# Altium project DB-X01.PrjPcb (part 2 of 5)
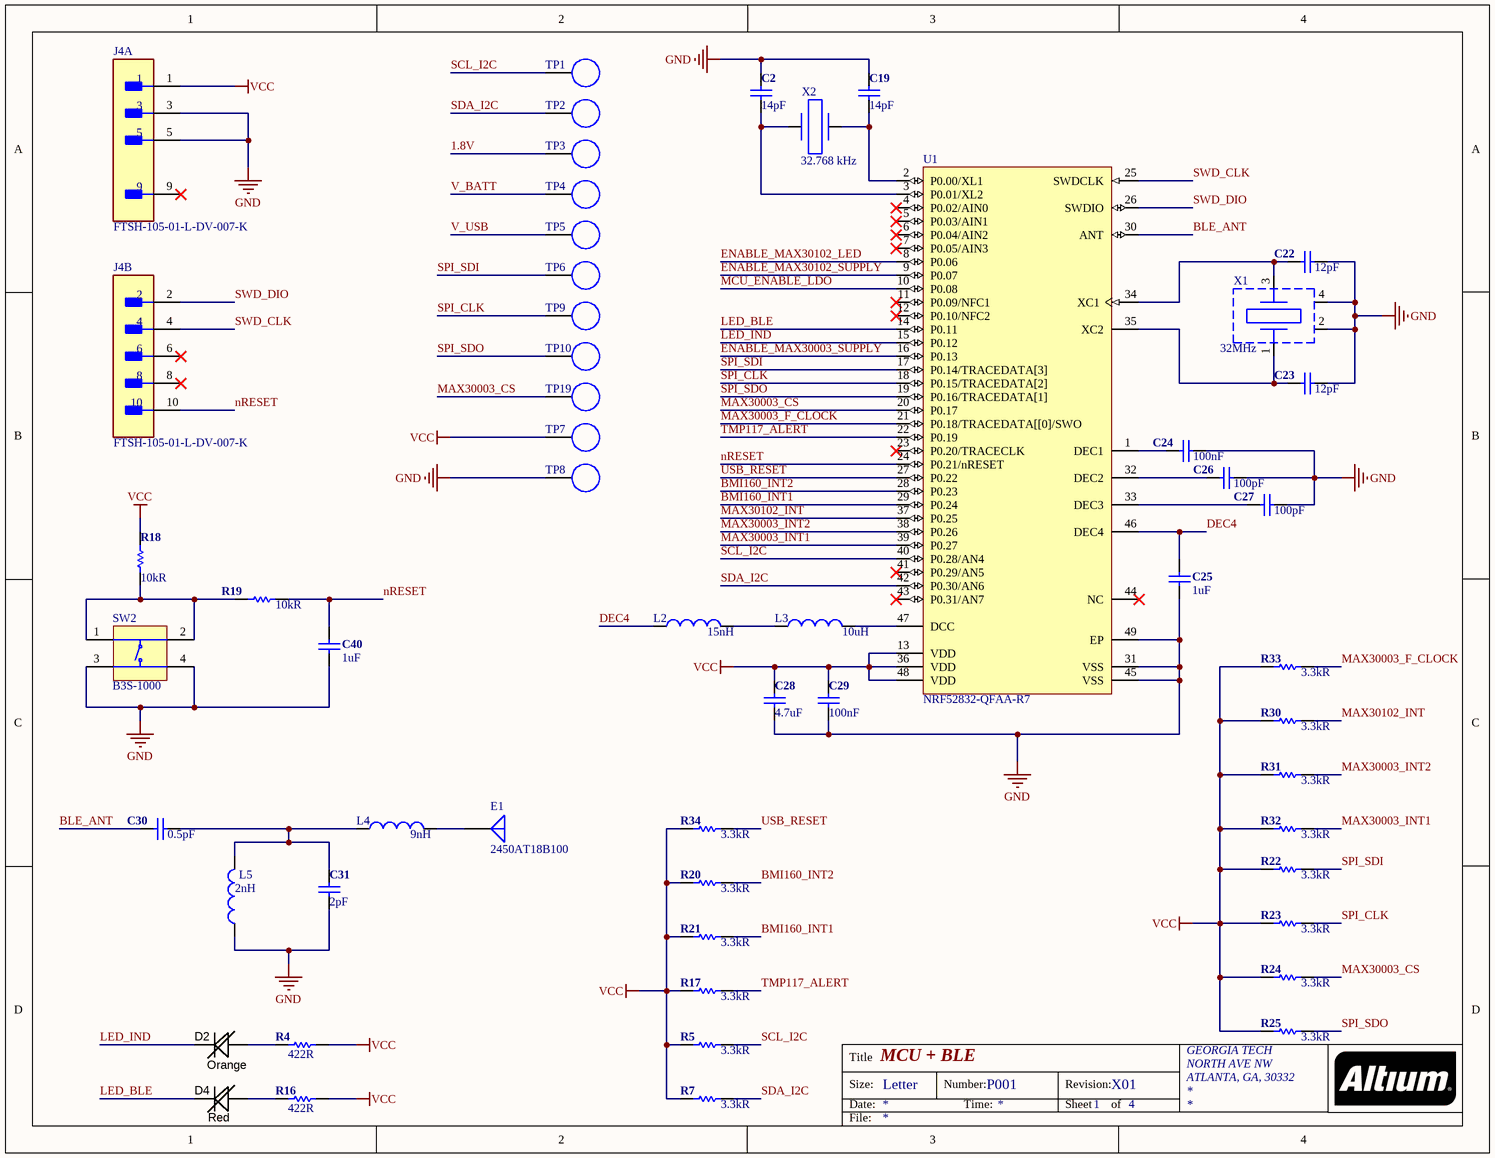
[diagram p2: DB_Main-X01.SchDoc]

## Sheet DB_Main-X01.SchDoc: MCU + BLE (continued)

### Library data of the parts
C2 C19 = C-0402(1005): Ceramic Capacitor, Multilayer, Ceramic, 50V, 1% +Tol, 1% -Tol, C0G, 30ppm/Cel TC, 0.000014uF, Surface Mount, 0402; Manufacturer: Kyocera AVX; Manufacturer Part Number: 04025U140FAT2A; ComponentLink1URL: https://datasheet.ciiva.com/169/product-169683.pdf; ComponentLink1Description: https://datasheet.ciiva.com/169/product-169683.pdf; Supplier 1: Digi-Key; Supplier Part Number 1: 478-10139-1-ND; RoHS: Yes; Category: Ceramic Capacitors; Stock 1: 25036; Pricing 1: 1=0.35000, 10=0.24100, 100=0.14460, 500=0.10846, 1000=0.09158, 2500=0.08676, 5000=0.08194 (USD); Mount: Surface Mount; Case/Package: 0402; Case Code (Imperial): 0402; Case Code (Metric): 1005; Min Operating Temperature: -55°C; Max Operating Temperature: 125°C; Dielectric: C0G; Capacitance: 14pF; Package Quantity: 10000; Voltage Rating: 50V; Voltage Rating (DC): 50V; Tolerance: 1%; Packaging: Tape and Reel; Termination: SMD/SMT; Composition: Ceramic; Length: 1mm; Width: 0.5mm; Thickness: 0.022inch; Depth: 0.5mm; Radiation Hardening: No; ComponentLink2URL: https://datasheet.ciiva.com:443/pdfs/VipMasterIC/IC/AVXC/AVXC-S-A0001948465/AVXC-S-A0001948465-1.pdf?src-supplier=IHS+Markit; ComponentLink2Description: https://datasheet.ciiva.com:443/pdfs/VipMasterIC/IC/AVXC/AVXC-S-A0001948465/AVXC-S-A0001948465-1.pdf?src-supplier=IHS+Markit; ComponentLink3URL: https://datasheet.ciiva.com/6269/useries-6269558.pdf?src-supplier=Digi-Key; ComponentLink3Description: https://datasheet.ciiva.com/6269/useries-6269558.pdf?src-supplier=Digi-Key; ComponentLink4URL: https://datasheet.ciiva.com/11568/useries-11568551.pdf?src-supplier=Avnet; ComponentLink4Description: https://datasheet.ciiva.com/11568/useries-11568551.pdf?src-supplier=Avnet
C22 C23 = C-0402(1005): Ceramic Capacitor, Multilayer, Ceramic, 50V, 1% +Tol, 1% -Tol, C0G, 30ppm/Cel TC, 0.000012uF, Surface Mount, 0402; Manufacturer: Kyocera AVX; Manufacturer Part Number: 04025U120FAT2A; ComponentLink1URL: https://datasheet.ciiva.com/169/product-169683.pdf; ComponentLink1Description: https://datasheet.ciiva.com/169/product-169683.pdf; Supplier 1: Digi-Key; Supplier Part Number 1: 478-10136-1-ND; RoHS: Yes; Category: Ceramic Capacitors; Stock 1: 30880; Pricing 1: 1=0.33000, 10=0.22700, 100=0.13630, 500=0.10220, 1000=0.08630, 2500=0.08176, 5000=0.07721 (USD); Mount: Surface Mount; Case/Package: 0402; Weight: 2.3E-05oz; Case Code (Metric): 1005; Case Code (Imperial): 0402; Min Operating Temperature: -55°C; Max Operating Temperature: 125°C; Termination: SMD/SMT; Composition: Ceramic; Tolerance: 1%; Packaging: Tape and Reel; Package Quantity: 10000; Capacitance: 12pF; Voltage Rating: 50V; Voltage Rating (DC): 50V; Dielectric: C0G; Length: 1mm; Height: 0.02mm; Thickness: 0.022inch; Depth: 0.5mm; Width: 0.02inch; Radiation Hardening: No; Lead Free: Lead Free; ComponentLink2URL: https://datasheet.ciiva.com:443/pdfs/VipMasterIC/IC/AVXC/AVXC-S-A0008668660/AVXC-S-A0008668660-1.pdf?src-supplier=IHS+Markit; ComponentLink2Description: https://datasheet.ciiva.com:443/pdfs/VipMasterIC/IC/AVXC/AVXC-S-A0008668660/AVXC-S-A0008668660-1.pdf?src-supplier=IHS+Markit; ComponentLink3URL: https://datasheet.ciiva.com/16327/useries-16327642.pdf?src-supplier=Future+Electronics; ComponentLink3Description: https://datasheet.ciiva.com/16327/useries-16327642.pdf?src-supplier=Future+Electronics; ComponentLink4URL: https://datasheet.ciiva.com/11568/useries-11568940.pdf?src-supplier=Avnet; ComponentLink4Description: https://datasheet.ciiva.com/11568/useries-11568940.pdf?src-supplier=Avnet
C24 = C-0402(1005): Ceramic Capacitor, Multilayer, Ceramic, 25V, 10% +Tol, 10% -Tol, X5R, 15% TC, 0.1uF, Surface Mount, 0402; Manufacturer: Taiyo Yuden; Manufacturer Part Number: TMK105BJ104KV-F; ComponentLink1URL: https://datasheet.ciiva.com/169/product-169683.pdf; ComponentLink1Description: https://datasheet.ciiva.com/169/product-169683.pdf; Supplier 1: Digi-Key; Supplier Part Number 1: 587-1456-1-ND; RoHS: Yes; Category: Ceramic Capacitors; Stock 1: 27456801; Pricing 1: 1=0.10000, 10=0.04600, 100=0.02050, 500=0.01464, 1000=0.01150, 2500=0.01045, 5000=0.00961 (USD); Mount: Surface Mount; Case/Package: 0402; Number of Pins: 2; Weight: 2.3E-05oz; Case Code (Imperial): 0402; Case Code (Metric): 1005; Min Operating Temperature: -55°C; Max Operating Temperature: 85°C; Capacitance: 100nF; Tolerance: 10%; Packaging: Tape and Reel; Dielectric: X5R; Voltage Rating (DC): 25V; Voltage Rating: 25V; Package Quantity: 1; Termination: SMD/SMT; Composition: Ceramic; Voltage: 25V; Length: 1mm; Height: 0.5mm; Width: 0.5mm; Depth: 0.5mm; Thickness: 0.022inch; REACH SVHC: No SVHC; Lead Free: Lead Free; Halogen Free: Halogen Free; ComponentLink2URL: https://datasheet.ciiva.com:443/pdfs/VipMasterIC/IC/TAIY/TAIY-S-A0009103435/TAIY-S-A0009103038-1.pdf?src-supplier=IHS+Markit; ComponentLink2Description: https://datasheet.ciiva.com:443/pdfs/VipMasterIC/IC/TAIY/TAIY-S-A0009103435/TAIY-S-A0009103038-1.pdf?src-supplier=IHS+Markit; ComponentLink3URL: https://datasheet.ciiva.com/30051/25tmk105bj104kv-f-30051094.pdf?src-supplier=Onlinecomponents.com; ComponentLink3Description: https://datasheet.ciiva.com/30051/25tmk105bj104kv-f-30051094.pdf?src-supplier=Onlinecomponents.com; ComponentLink4URL: https://datasheet.ciiva.com/15922/28tmk105bj104kv-f-15922315.pdf?src-supplier=Onlinecomponents.com; ComponentLink4Description: https://datasheet.ciiva.com/15922/28tmk105bj104kv-f-15922315.pdf?src-supplier=Onlinecomponents.com; ComponentLink5URL: https://datasheet.ciiva.com/131/tmk105bj104kv-f-ss-131420.pdf?src-supplier=Digi-Key; ComponentLink5Description: https://datasheet.ciiva.com/131/tmk105bj104kv-f-ss-131420.pdf?src-supplier=Digi-Key; ComponentLink6URL: https://datasheet.ciiva.com/22768/1693457-22768649.pdf?src-supplier=Farnell; ComponentLink6Description: https://datasheet.ciiva.com/22768/1693457-22768649.pdf?src-supplier=Farnell
C25 C40 = C-0402(1005): Ceramic Capacitor, Multilayer, Ceramic, 6.3V, 20% +Tol, 20% -Tol, X5R, 15% TC, 1uF, Surface Mount, 0402; Manufacturer: Yageo; Manufacturer Part Number: CC0402MRX5R5BB105; Dissipation Factor: 10%; ComponentLink1URL: https://datasheet.ciiva.com/169/product-169683.pdf; ComponentLink1Description: https://datasheet.ciiva.com/169/product-169683.pdf; Supplier 1: Digi-Key; Supplier Part Number 1: 311-1441-1-ND; RoHS: Yes; Category: Ceramic Capacitors; Stock 1: 16697; Pricing 1: 1=0.13000, 10=0.08900, 100=0.04200, 500=0.02946, 1000=0.02439, 2500=0.02270, 5000=0.02076 (USD); Mount: Surface Mount; Case/Package: 0402; Number of Pins: 2; Case Code (Imperial): 0402; Case Code (Metric): 1005; Min Operating Temperature: -55°C; Max Operating Temperature: 85°C; Capacitance: 1uF; Tolerance: 20%; Voltage Rating: 6.3V; Voltage Rating (DC): 6.3V; Packaging: Tape and Reel; Package Quantity: 1; Dielectric: X5R; Termination: SMD/SMT; Composition: Ceramic; Length: 1mm; Height: 0.5mm; Width: 0.5mm; Thickness: 0.022inch; Depth: 0.5mm; Lead Free: Lead Free; Halogen Free: Halogen Free; ComponentLink2URL: https://datasheet.ciiva.com:443/pdfs/VipMasterIC/IC/YAGO/YAGO-S-A0006851646/YAGO-S-A0006851646-1.pdf?src-supplier=IHS+Markit; ComponentLink2Description: https://datasheet.ciiva.com:443/pdfs/VipMasterIC/IC/YAGO/YAGO-S-A0006851646/YAGO-S-A0006851646-1.pdf?src-supplier=IHS+Markit; ComponentLink3URL: https://datasheet.ciiva.com/176/mlccorderingcode-176806.pdf?src-supplier=Digi-Key; ComponentLink3Description: https://datasheet.ciiva.com/176/mlccorderingcode-176806.pdf?src-supplier=Digi-Key; ComponentLink4URL: https://datasheet.ciiva.com/176/mlccorderingcode-176807.pdf?src-supplier=Digi-Key; ComponentLink4Description: https://datasheet.ciiva.com/176/mlccorderingcode-176807.pdf?src-supplier=Digi-Key; ComponentLink5URL: https://datasheet.ciiva.com/176/mlccorderingcode-176808.pdf?src-supplier=Digi-Key; ComponentLink5Description: https://datasheet.ciiva.com/176/mlccorderingcode-176808.pdf?src-supplier=Digi-Key
C26 C27 = C-0402(1005): Ceramic Capacitor, Multilayer, Ceramic, 50V, 1% +Tol, 1% -Tol, C0G, 30ppm/Cel TC, 0.0001uF, Surface Mount, 0402; Manufacturer: Yageo; Manufacturer Part Number: CC0402FRNPO9BN101; ComponentLink1URL: https://datasheet.ciiva.com/169/product-169683.pdf; ComponentLink1Description: https://datasheet.ciiva.com/169/product-169683.pdf; Supplier 1: Digi-Key; Supplier Part Number 1: 311-3329-1-ND; RoHS: Yes; Category: Ceramic Capacitors; Stock 1: 22812; Pricing 1: 1=0.11000, 10=0.08200, 100=0.03840, 500=0.02690, 1000=0.02228, 2500=0.02073, 5000=0.01897 (USD); Mount: Surface Mount; Case/Package: 0402; Case Code (Imperial): 0402; Case Code (Metric): 1005; Min Operating Temperature: -55°C; Max Operating Temperature: 125°C; Package Quantity: 10000; Voltage Rating (DC): 50V; Dielectric: C0G; Termination: SMD/SMT; Composition: Ceramic; Packaging: Tape and Reel; Capacitance: 100pF; Tolerance: 1%; Voltage Rating: 50V; Length: 1mm; Width: 0.02inch; Thickness: 0.022inch; Depth: 0.5mm; Lead Free: Lead Free; ComponentLink2URL: https://datasheet.ciiva.com:443/pdfs/VipMasterIC/IC/YAGO/YAGO-S-A0009251638/YAGO-S-A0009251638-1.pdf?src-supplier=IHS+Markit; ComponentLink2Description: https://datasheet.ciiva.com:443/pdfs/VipMasterIC/IC/YAGO/YAGO-S-A0009251638/YAGO-S-A0009251638-1.pdf?src-supplier=IHS+Markit; ComponentLink3URL: http://www.mouser.com/ds/2/447/Yageo_UPY-GP_NP0_16V-to-50V_9-358835.pdf?src-supplier=Mouser; ComponentLink3Description: http://www.mouser.com/ds/2/447/Yageo_UPY-GP_NP0_16V-to-50V_9-358835.pdf?src-supplier=Mouser; ComponentLink4URL: http://components.arrow.com/part/dataview/0323_00775990?src-supplier=Arrow+Europe; ComponentLink4Description: http://components.arrow.com/part/dataview/0323_00775990?src-supplier=Arrow+Europe; ComponentLink5URL: http://www.yageo.com/NewPortal/yageodocoutput?fileName=/pdf/MLCC/UPY-GP_NP0_16V-to-50V_14.pdf&src-supplier=Digi-Key; ComponentLink5Description: http://www.yageo.com/NewPortal/yageodocoutput?fileName=/pdf/MLCC/UPY-GP_NP0_16V-to-50V_14.pdf&src-supplier=Digi-Key; ComponentLink6URL: http://www.yageo.com/documents/recent/UPY-GP_NP0_16V-to-50V_16.pdf?src-supplier=Digi-Key; ComponentLink6Description: http://www.yageo.com/documents/recent/UPY-GP_NP0_16V-to-50V_16.pdf?src-supplier=Digi-Key; ComponentLink7URL: http://www.yageo.com/documents/recent/UPY-GP_NP0_16V-to-50V_9.pdf?src-supplier=Future+Electronics; ComponentLink7Description: http://www.yageo.com/documents/recent/UPY-GP_NP0_16V-to-50V_9.pdf?src-supplier=Future+Electronics
C28 = C-0402(1005): 0402 10 V 4.7 uF ±20% Tolerance X5R Multilayer Ceramic Chip Capacitor; Manufacturer: Murata; Manufacturer Part Number: GRM155R61A475MEAAD; Voltage Rating: 10V; ComponentLink1URL: https://datasheet.ciiva.com/169/product-169683.pdf; ComponentLink1Description: https://datasheet.ciiva.com/169/product-169683.pdf; Supplier 1: Digi-Key; Supplier Part Number 1: 490-14306-1-ND; Category: Ceramic Capacitors; Stock 1: 420733; Pricing 1: 1=0.25000, 10=0.16900, 100=0.08560, 500=0.05854, 1000=0.05179, 2500=0.04954, 5000=0.04503 (USD); Mount: Surface Mount; Case/Package: 0402; Case Code (Imperial): 0402; Case Code (Metric): 1005; Min Operating Temperature: -55°C; Max Operating Temperature: 85°C; Packaging: Tape and Reel; Capacitance: 4.7uF; Tolerance: 20%; ComponentLink2URL: https://psearch.en.murata.com:443/capacitor/product/GRM155R61A475MEAA%23.pdf?src-supplier=IHS+Markit; ComponentLink2Description: https://psearch.en.murata.com:443/capacitor/product/GRM155R61A475MEAA%23.pdf?src-supplier=IHS+Markit; ComponentLink3URL: http://www.farnell.com/datasheets/2189109.pdf?src-supplier=Farnell; ComponentLink3Description: http://www.farnell.com/datasheets/2189109.pdf?src-supplier=Farnell; ComponentLink4URL: https://search.murata.co.jp/Ceramy/image/img/A01X/G101/ENG/GRM155R61A475MEAA-01.pdf?src-supplier=Digi-Key; ComponentLink4Description: https://search.murata.co.jp/Ceramy/image/img/A01X/G101/ENG/GRM155R61A475MEAA-01.pdf?src-supplier=Digi-Key; ComponentLink5URL: http://www.farnell.com/datasheets/2189109.pdf?src-supplier=Element14; ComponentLink5Description: http://www.farnell.com/datasheets/2189109.pdf?src-supplier=Element14; ComponentLink6URL: http://www.farnell.com/datasheets/2189109.pdf?src-supplier=Newark; ComponentLink6Description: http://www.farnell.com/datasheets/2189109.pdf?src-supplier=Newark; ComponentLink7URL: http://datasheet.octopart.com/GRM155R61A475MEAAD-Murata-datasheet-138740730.pdf?src-supplier=Ciiva+Crawler; ComponentLink7Description: http://datasheet.octopart.com/GRM155R61A475MEAAD-Murata-datasheet-138740730.pdf?src-supplier=Ciiva+Crawler; ComponentLink8URL: http://datasheet.octopart.com/GRM155R61A475MEAAD-Murata-datasheet-140690084.pdf?src-supplier=Ciiva+Crawler; ComponentLink8Description: http://datasheet.octopart.com/GRM155R61A475MEAAD-Murata-datasheet-140690084.pdf?src-supplier=Ciiva+Crawler; ComponentLink9URL: http://datasheet.octopart.com/GRM155R61A475MEAAD-Murata-datasheet-68589269.pdf?src-supplier=Newark; ComponentLink9Description: http://datasheet.octopart.com/GRM155R61A475MEAAD-Murata-datasheet-68589269.pdf?src-supplier=Newark; ComponentLink10URL: http://datasheet.octopart.com/GRM155R61A475MEAAD-Murata-datasheet-8819587.pdf; ComponentLink10Description: http://datasheet.octopart.com/GRM155R61A475MEAAD-Murata-datasheet-8819587.pdf; ComponentLink11URL: http://datasheet.octopart.com/GRM155R61A475MEAAD-Murata-datasheet-10025737.pdf; ComponentLink11Description: http://datasheet.octopart.com/GRM155R61A475MEAAD-Murata-datasheet-10025737.pdf; ComponentLink12URL: http://datasheet.octopart.com/GRM155R61A475MEAAD-Murata-datasheet-11978611.pdf; ComponentLink12Description: http://datasheet.octopart.com/GRM155R61A475MEAAD-Murata-datasheet-11978611.pdf; ComponentLink13URL: http://datasheet.octopart.com/GRM155R61A475MEAAD-Murata-datasheet-12510076.pdf; ComponentLink13Description: http://datasheet.octopart.com/GRM155R61A475MEAAD-Murata-datasheet-12510076.pdf; ComponentLink14URL: http://datasheet.octopart.com/GRM155R61A475MEAAD-Murata-datasheet-12515295.pdf; ComponentLink14Description: http://datasheet.octopart.com/GRM155R61A475MEAAD-Murata-datasheet-12515295.pdf
C29 = C-0603(1608): Ceramic Capacitor, Multilayer, Ceramic, 25V, 80% +Tol, 20% -Tol, Y5V, -82/+22% TC, 0.1uF, Surface Mount, 0402; Manufacturer: Yageo; Manufacturer Part Number: CC0402ZRY5V8BB104; Dissipation Factor: 12.5%; Insulation Resistance: 10GR; ComponentLink1URL: https://datasheet.ciiva.com/169/product-169683.pdf; ComponentLink1Description: https://datasheet.ciiva.com/169/product-169683.pdf; Supplier 1: Digi-Key; Supplier Part Number 1: 311-1375-1-ND; RoHS: Yes; Category: Ceramic Capacitors; Stock 1: 3200380; Pricing 1: 1=0.10000, 10=0.03200, 100=0.01440, 500=0.01028, 1000=0.00808, 2500=0.00734, 5000=0.00676 (USD); Mount: Surface Mount; Case/Package: 0402; Number of Pins: 2; Weight: 2.3E-05oz; Case Code (Metric): 1005; Case Code (Imperial): 0402; Min Operating Temperature: -30°C; Max Operating Temperature: 85°C; Packaging: Tape and Reel; Capacitance: 100nF; Tolerance: 80%; Voltage Rating: 25V; Voltage Rating (DC): 25V; Package Quantity: 1; Dielectric: Y5V; Termination: SMD/SMT; Composition: Ceramic; Length: 1mm; Height: 0.5mm; Width: 0.02inch; Thickness: 0.022inch; Depth: 0.5mm; Radiation Hardening: No; REACH SVHC: Unknown; Lead Free: Lead Free; Halogen Free: Halogen Free; ComponentLink2URL: https://datasheet.ciiva.com:443/pdfs/VipMasterIC/IC/YAGO/YAGO-S-A0004841839/YAGO-S-A0004841839-1.pdf?src-supplier=IHS+Markit; ComponentLink2Description: https://datasheet.ciiva.com:443/pdfs/VipMasterIC/IC/YAGO/YAGO-S-A0004841839/YAGO-S-A0004841839-1.pdf?src-supplier=IHS+Markit; ComponentLink3URL: https://datasheet.ciiva.com/144/mlccorderingcode-144022.pdf?src-supplier=Digi-Key; ComponentLink3Description: https://datasheet.ciiva.com/144/mlccorderingcode-144022.pdf?src-supplier=Digi-Key; ComponentLink4URL: https://datasheet.ciiva.com/144/mlccorderingcode-144023.pdf?src-supplier=Digi-Key; ComponentLink4Description: https://datasheet.ciiva.com/144/mlccorderingcode-144023.pdf?src-supplier=Digi-Key; ComponentLink5URL: https://datasheet.ciiva.com/144/mlccorderingcode-144024.pdf?src-supplier=Digi-Key; ComponentLink5Description: https://datasheet.ciiva.com/144/mlccorderingcode-144024.pdf?src-supplier=Digi-Key; ComponentLink6URL: https://datasheet.ciiva.com/7978/1132289-7978124.pdf?src-supplier=Element14; ComponentLink6Description: https://datasheet.ciiva.com/7978/1132289-7978124.pdf?src-supplier=Element14; ComponentLink7URL: https://datasheet.ciiva.com/11586/upy-gphc-y5v-6-3v-to-50v-5-11586526.pdf?src-supplier=Avnet; ComponentLink7Description: https://datasheet.ciiva.com/11586/upy-gphc-y5v-6-3v-to-50v-5-11586526.pdf?src-supplier=Avnet; ComponentLink8URL: https://datasheet.ciiva.com/17437/upy-gphc-y5v-6-3v-to-50v-5-17437230.pdf?src-supplier=Avnet+Europe; ComponentLink8Description: https://datasheet.ciiva.com/17437/upy-gphc-y5v-6-3v-to-50v-5-17437230.pdf?src-supplier=Avnet+Europe
C30 = C-0402(1005): Ceramic Capacitor, Multilayer, Ceramic, 50V, 10% +Tol, 10% -Tol, C0G, 30ppm/Cel TC, 0.0000005uF, Surface Mount, 0402; Manufacturer: Murata; Manufacturer Part Number: GJM1555C1HR50WB01D; ComponentLink1URL: https://datasheet.ciiva.com/169/product-169683.pdf; ComponentLink1Description: https://datasheet.ciiva.com/169/product-169683.pdf; Supplier 1: Digi-Key; Supplier Part Number 1: 490-11250-1-ND; RoHS: Yes; Category: Ceramic Capacitors; Stock 1: 75988; Pricing 1: 1=0.30000, 10=0.20500, 100=0.11610, 500=0.08198, 1000=0.07173, 2500=0.06831, 5000=0.06319 (USD); Mount: Surface Mount; Case/Package: 0402; Case Code (Metric): 1005; Case Code (Imperial): 0402; Min Operating Temperature: -55°C; Max Operating Temperature: 125°C; Package Quantity: 10000; Capacitance: 0.5pF; Voltage Rating: 50V; Packaging: Tape and Reel; Voltage Rating (DC): 50V; Dielectric: C0G; Termination: SMD/SMT; Voltage: 50V; Length: 1mm; Height: 0.5mm; Width: 0.02inch; Thickness: 0.022inch; Depth: 0.5mm; Radiation Hardening: No; Lead Free: Lead Free; ComponentLink2URL: https://datasheet.ciiva.com:443/pdfs/VipMasterIC/IC/MURE/MURE-S-A0004378008/MURE-S-A0004383131-1.pdf?src-supplier=IHS+Markit; ComponentLink2Description: https://datasheet.ciiva.com:443/pdfs/VipMasterIC/IC/MURE/MURE-S-A0004378008/MURE-S-A0004383131-1.pdf?src-supplier=IHS+Markit; ComponentLink3URL: https://datasheet.ciiva.com/169/product-169683.pdf?src-supplier=Digi-Key; ComponentLink3Description: https://datasheet.ciiva.com/169/product-169683.pdf?src-supplier=Digi-Key
C31 = C-0402(1005): Ceramic Capacitor, Multilayer, Ceramic, 50V, 5% +Tol, 5% -Tol, C0G, 30ppm/Cel TC, 0.000002uF, Surface Mount, 0402; Manufacturer: Murata; Manufacturer Part Number: GJM1555C1H2R0BB01D; ComponentLink1URL: https://datasheet.ciiva.com/169/product-169683.pdf; ComponentLink1Description: https://datasheet.ciiva.com/169/product-169683.pdf; Supplier 1: Digi-Key; Supplier Part Number 1: 490-8091-1-ND; RoHS: Yes; Category: Ceramic Capacitors; Stock 1: 969; Pricing 1: 1=0.19000, 10=0.13000, 100=0.06590, 500=0.04508, 1000=0.03987, 2500=0.03814, 5000=0.03467 (USD); Mount: Surface Mount; Case/Package: 0402; Number of Pins: 2; Case Code (Metric): 1005; Case Code (Imperial): 0402; Min Operating Temperature: -55°C; Max Operating Temperature: 125°C; Package Quantity: 1; Packaging: Tape and Reel; Capacitance: 2pF; Voltage Rating: 50V; Voltage Rating (DC): 50V; Dielectric: C0G; Termination: SMD/SMT; Length: 1mm; Height: 0.5mm; Width: 0.5mm; Thickness: 0.022inch; Lead Pitch: 0.3mm; Depth: 0.5mm; Radiation Hardening: No; REACH SVHC: No SVHC; Lead Free: Lead Free; ComponentLink2URL: https://datasheet.ciiva.com:443/pdfs/VipMasterIC/IC/MURE/MURE-S-A0008911154/MURE-S-A0008911197-1.pdf?src-supplier=IHS+Markit; ComponentLink2Description: https://datasheet.ciiva.com:443/pdfs/VipMasterIC/IC/MURE/MURE-S-A0008911154/MURE-S-A0008911197-1.pdf?src-supplier=IHS+Markit; ComponentLink3URL: https://datasheet.ciiva.com/5694/1700193-5694978.pdf?src-supplier=Farnell; ComponentLink3Description: https://datasheet.ciiva.com/5694/1700193-5694978.pdf?src-supplier=Farnell; ComponentLink4URL: https://datasheet.ciiva.com/17453/product-17453487.pdf?src-supplier=Avnet+Europe; ComponentLink4Description: https://datasheet.ciiva.com/17453/product-17453487.pdf?src-supplier=Avnet+Europe; ComponentLink5URL: https://datasheet.ciiva.com/16440/l0005e-16440476.pdf?src-supplier=Future+Electronics; ComponentLink5Description: https://datasheet.ciiva.com/16440/l0005e-16440476.pdf?src-supplier=Future+Electronics
D2 = LED_0402(1005): Single Color LED, Super Bright Orange, Water Clear, 0.8mm; Manufacturer: Kingbright; Manufacturer Part Number: APHHS1005SECK; Number of LEDs: 1; Dominant Wavelength: 601nm; Test Current: 20mA; Viewing Angle: 120°; Lens Style: Clear,Flat; Luminous Intensity: 240mcd; Forward Voltage: 2.1V; Supplier 1: Digi-Key; Supplier Part Number 1: 754-1103-1-ND; RoHS: Yes; Category: LEDs; Stock 1: 18062; Pricing 1: 1=0.50000, 10=0.35400, 100=0.20650, 500=0.14160, 1000=0.11800 (USD); Mount: Surface Mount; Case/Package: 0402; Number of Pins: 2; Lens Color: Clear; Color: Orange; Case Code (Imperial): 0402; Case Code (Metric): 1005; Min Operating Temperature: -40°C; Max Operating Temperature: 85°C; Package Quantity: 2000; Packaging: Tape and Reel; Wavelength: 601nm; Illumination Color: Orange; Forward Current: 20mA; Length: 1mm; Height: 0.6mm; Width: 0.5mm; Lead Free: Lead Free; ComponentLink1URL: https://datasheet.ciiva.com:443/pdfs/VipMasterIC/IC/KNGB/KNGBS06640/KNGBS06640-1.pdf?src-supplier=IHS+Markit; ComponentLink1Description: https://datasheet.ciiva.com:443/pdfs/VipMasterIC/IC/KNGB/KNGBS06640/KNGBS06640-1.pdf?src-supplier=IHS+Markit; ComponentLink2URL: https://datasheet.ciiva.com/2114/aphhs1005seck-2114149.pdf?src-supplier=Digi-Key; ComponentLink2Description: https://datasheet.ciiva.com/2114/aphhs1005seck-2114149.pdf?src-supplier=Digi-Key; ComponentLink3URL: https://datasheet.ciiva.com/4688/aphhs1005seck-36485-4688716.pdf?src-supplier=Mouser; ComponentLink3Description: https://datasheet.ciiva.com/4688/aphhs1005seck-36485-4688716.pdf?src-supplier=Mouser; ComponentLink4URL: https://datasheet.ciiva.com/2114/aphhs1005seck-2114150.pdf?src-supplier=Digi-Key; ComponentLink4Description: https://datasheet.ciiva.com/2114/aphhs1005seck-2114150.pdf?src-supplier=Digi-Key; ComponentLink5URL: https://datasheet.ciiva.com/2114/aphhs1005seck-2114151.pdf?src-supplier=Digi-Key; ComponentLink5Description: https://datasheet.ciiva.com/2114/aphhs1005seck-2114151.pdf?src-supplier=Digi-Key; ComponentLink6URL: https://datasheet.ciiva.com/16412/aphhs1005seck-16412186.pdf?src-supplier=Future+Electronics; ComponentLink6Description: https://datasheet.ciiva.com/16412/aphhs1005seck-16412186.pdf?src-supplier=Future+Electronics
D4 = LED_0402(1005): Single Color LED, Hyper Red, Water Clear, 0.8mm; Manufacturer: Kingbright; Manufacturer Part Number: APHHS1005SURCK; Forward Current: 20mA; Forward Voltage: 1.95V; Luminous Intensity: 220mcd; Viewing Angle: 120°; Wavelength: 635nm; Lens Style: Clear,Flat; Dominant Wavelength: 630nm; Number of LEDs: 1; Supplier 1: Digi-Key; Supplier Part Number 1: 754-1104-1-ND; RoHS: Yes; Category: LEDs; Stock 1: 12156; Pricing 1: 1=0.50000, 10=0.35400, 100=0.20650, 500=0.14160, 1000=0.11800 (USD); Mount: Surface Mount; Case/Package: 0402; Number of Pins: 2; Color: Red; Case Code (Metric): 1005; Case Code (Imperial): 0402; Lens Color: Clear; Min Operating Temperature: -40°C; Max Operating Temperature: 85°C; Packaging: Tape and Reel; Package Quantity: 2000; Illumination Color: Red; Test Current: 20mA; Length: 1mm; Height: 0.6mm; Width: 0.5mm; Lead Free: Lead Free; ComponentLink1URL: https://datasheet.ciiva.com:443/pdfs/VipMasterIC/IC/KBEC/KBEC-S-A0008947180/KBEC-S-A0008958151-1.pdf?src-supplier=IHS+Markit; ComponentLink1Description: https://datasheet.ciiva.com:443/pdfs/VipMasterIC/IC/KBEC/KBEC-S-A0008947180/KBEC-S-A0008958151-1.pdf?src-supplier=IHS+Markit; ComponentLink2URL: https://datasheet.ciiva.com/4689/aphhs1005surck-32322-4689068.pdf?src-supplier=Mouser; ComponentLink2Description: https://datasheet.ciiva.com/4689/aphhs1005surck-32322-4689068.pdf?src-supplier=Mouser; ComponentLink3URL: https://datasheet.ciiva.com/2114/aphhs1005surck-2114140.pdf?src-supplier=Digi-Key; ComponentLink3Description: https://datasheet.ciiva.com/2114/aphhs1005surck-2114140.pdf?src-supplier=Digi-Key; ComponentLink4URL: https://datasheet.ciiva.com/14603/70062833-14603899.pdf?src-supplier=Allied+Electronics; ComponentLink4Description: https://datasheet.ciiva.com/14603/70062833-14603899.pdf?src-supplier=Allied+Electronics; ComponentLink5URL: https://datasheet.ciiva.com/2114/aphhs1005surck-2114142.pdf?src-supplier=Digi-Key; ComponentLink5Description: https://datasheet.ciiva.com/2114/aphhs1005surck-2114142.pdf?src-supplier=Digi-Key; ComponentLink6URL: https://datasheet.ciiva.com/2114/aphhs1005surck-2114141.pdf?src-supplier=Digi-Key; ComponentLink6Description: https://datasheet.ciiva.com/2114/aphhs1005surck-2114141.pdf?src-supplier=Digi-Key
E1 = 2450AT18B100: 2.4 GHz BLE Antenna; Manufacturer: Johanson; Manufacturer Part Number: 2450AT18B100E; Description 1: JOHANSON TECHNOLOGY         2450AT18B100E             ANTENNA, CERAMIC, 2.45GHZ; Impedance: 50R; Bandwidth: 100MHz; Power Rating: 3W; Frequency: 2.45GHz; Number of Bands: 1; Return Loss: -9.5dB; Max Frequency: 2.5GHz; Gain: -0.5dB; Supplier 1: Digi-Key; Supplier Part Number 1: 712-1006-1-ND; Stock 1: 187598; Pricing 1: 1=0.62, 10=0.541, 25=0.4788, 100=0.4172, 250=0.3631, 500=0.309, 1000=0.2472 (USD); Mount: Surface Mount; Case/Package: CSMD; Contact Plating: Tin; Packaging: Tape and Reel; Package Quantity: 1; Max Power Dissipation: 3W; Termination: Solder; Length: 3.2mm; Height: 0.051inch; Width: 1.6mm; REACH SVHC: No SVHC; ComponentLink1URL: https://datasheet.ciiva.com/1124/1318299-1124918.pdf; ComponentLink1Description: https://datasheet.ciiva.com/1124/1318299-1124918.pdf; ComponentLink2URL: https://datasheet.ciiva.com/24025/antenna-2450at18b100-242422-24025839.pdf; ComponentLink2Description: https://datasheet.ciiva.com/24025/antenna-2450at18b100-242422-24025839.pdf
J4 = 7c368be3265735b2816d0cab4417f87: CONN HEADER SMD 10POS 1.27MM; Manufacturer: Samtec; Connector Type: Male Pin; Number of Positions: 10; Number of Positions Loaded: 9; Current Rating: 3.4A; Supplier 1: Digi-Key; Supplier Part Number 1: SAM9438-ND; Manufacturer Part Number: FTSH-105-01-L-DV-007-K; RoHS: No; Category: Headers and Wire Housings; Pricing 1: 1=3.43000, 10=3.28800, 100=2.74000, 500=2.32900, 1000=1.98650, 5000=1.78100 (USD); Mount: Surface Mount; Number of Pins: 10; Contact Plating: Gold; Contact Material: Bronze; Contact Shape: Square; Insulation Material: Polymer; Insulation Color: Black; Min Operating Temperature: -55°C; Max Operating Temperature: 125°C; Fastening Type: Push,Pull; Packaging: Rail/Tube; Number of Rows: 2; Termination: Solder; Flammability Rating: UL94 V-0; ComponentLink1URL: https://datasheet.ciiva.com:443/pdfs/VipMasterIC/IC/SAMI/SAMI-S-A0006911451/SAMI-S-A0006911451-1.pdf?src-supplier=IHS+Markit; ComponentLink1Description: https://datasheet.ciiva.com:443/pdfs/VipMasterIC/IC/SAMI/SAMI-S-A0006911451/SAMI-S-A0006911451-1.pdf?src-supplier=IHS+Markit; ComponentLink2URL: http://www.farnell.com/datasheets/2570365.pdf?src-supplier=Farnell; ComponentLink2Description: http://www.farnell.com/datasheets/2570365.pdf?src-supplier=Farnell; ComponentLink3URL: http://suddendocs.samtec.com/prints/ftsh-1xx-xx-xxx-dv-xxx-xxx-mkt.pdf?src-supplier=Digi-Key; ComponentLink3Description: http://suddendocs.samtec.com/prints/ftsh-1xx-xx-xxx-dv-xxx-xxx-mkt.pdf?src-supplier=Digi-Key; ComponentLink4URL: http://www.farnell.com/datasheets/2570365.pdf?src-supplier=Element14; ComponentLink4Description: http://www.farnell.com/datasheets/2570365.pdf?src-supplier=Element14; ComponentLink5URL: http://www.farnell.com/datasheets/2570365.pdf?src-supplier=Newark; ComponentLink5Description: http://www.farnell.com/datasheets/2570365.pdf?src-supplier=Newark
L2 = I-0402(1005): General Purpose Inductor, 0.015uH, 5%, 1 Element, Ferrite-Core, SMD, 0402; Manufacturer: Taiyo Yuden; Manufacturer Part Number: HK100515NJ-T; Core Material: Ferrite,Ceramic; Body Material: Ceramic; Current Rating: 320mA; Shielding: Unshielded; Self Resonant Frequency: 2.3GHz; Q Factor: 8; DC Resistance (DCR): 460mR; Test Frequency: 100MHz; Max DC Current: 300mA; Supplier 1: Digi-Key; Supplier Part Number 1: 587-1521-1-ND; RoHS: Yes; Category: Fixed Inductors; Stock 1: 127125; Pricing 1: 1=0.10000, 10=0.02900, 100=0.01960, 500=0.01582, 1000=0.01351, 2500=0.01208 (USD); Mount: Surface Mount; Case/Package: 0402; Number of Pins: 2; Case Code (Metric): 1005; Case Code (Imperial): 0402; Min Operating Temperature: -55°C; Max Operating Temperature: 125°C; Packaging: Tape and Reel; Inductance: 15nH; Package Quantity: 10000; Tolerance: 5%; Inductance Tolerance: 5%; Termination: SMD/SMT; DC Current: 320mA; Military Standard: Not; Length: 1.05mm; Height: 0.5mm; Width: 0.02inch; Height - Seated (Max): 0.022inch; Depth: 0.55mm; Radiation Hardening: No; Lead Free: Exempt; Halogen Free: Halogen Free; REACH SVHC: Unknown; ComponentLink1URL: https://datasheet.ciiva.com:443/pdfs/VipMasterIC/IC/TAIY/TAIY-S-A0009098652/TAIY-S-A0009098648-1.pdf?src-supplier=IHS+Markit; ComponentLink1Description: https://datasheet.ciiva.com:443/pdfs/VipMasterIC/IC/TAIY/TAIY-S-A0009098652/TAIY-S-A0009098648-1.pdf?src-supplier=IHS+Markit; ComponentLink2URL: https://datasheet.ciiva.com/6688/hk100515nj-t-ss-6688640.pdf?src-supplier=Digi-Key; ComponentLink2Description: https://datasheet.ciiva.com/6688/hk100515nj-t-ss-6688640.pdf?src-supplier=Digi-Key; ComponentLink3URL: https://datasheet.ciiva.com/8498/hk100515nj-t-ss-8498917.pdf?src-supplier=Avnet; ComponentLink3Description: https://datasheet.ciiva.com/8498/hk100515nj-t-ss-8498917.pdf?src-supplier=Avnet; ComponentLink4URL: https://datasheet.ciiva.com/26871/getdatasheetpartid-645793-26871605.pdf?src-supplier=Verical; ComponentLink4Description: https://datasheet.ciiva.com/26871/getdatasheetpartid-645793-26871605.pdf?src-supplier=Verical; ComponentLink5URL: https://datasheet.ciiva.com/15986/1443hk100515nj-t-15986294.pdf?src-supplier=Onlinecomponents.com; ComponentLink5Description: https://datasheet.ciiva.com/15986/1443hk100515nj-t-15986294.pdf?src-supplier=Onlinecomponents.com; ComponentLink6URL: https://datasheet.ciiva.com/30215/1387hk100515nj-t-30215366.pdf?src-supplier=Onlinecomponents.com; ComponentLink6Description: https://datasheet.ciiva.com/30215/1387hk100515nj-t-30215366.pdf?src-supplier=Onlinecomponents.com
L3 = I-0603(1608): General Purpose Inductor, 10uH, 10%, 1 Element, Ferrite-Core, SMD, 0603; Manufacturer: Taiyo Yuden; Manufacturer Part Number: CBMF1608T100K; DC Resistance (DCR): 468mR; Test Frequency: 2.52MHz; Max DC Current: 380mA; Saturation Current: 115mA; Shielding: Unshielded; Self Resonant Frequency: 32MHz; Supplier 1: Digi-Key; Supplier Part Number 1: 587-1720-1-ND; RoHS: Yes; Category: Fixed Inductors; Stock 1: 148191; Pricing 1: 1=0.27000, 10=0.23900, 100=0.16450, 500=0.14054, 1000=0.10764 (USD); Mount: Surface Mount; Case/Package: 0603; Core Material: Ferrite; Case Code (Metric): 1608; Case Code (Imperial): 0603; Min Operating Temperature: -40°C; Max Operating Temperature: 105°C; Composition: Wirewound; Inductance: 10uH; Termination: SMD/SMT; DC Current: 380mA; Military Standard: Not; Package Quantity: 3000; Current Rating: 380mA; Tolerance: 10%; Packaging: Tape and Reel; Inductance Tolerance: 10%; Length: 0.063inch; Height: 0.8mm; Height - Seated (Max): 0.039inch; Depth: 1mm; Width: 0.031inch; Radiation Hardening: No; REACH SVHC: Unknown; Lead Free: Lead Free; Halogen Free: Halogen Free; ComponentLink1URL: https://datasheet.ciiva.com:443/pdfs/VipMasterIC/IC/TAIY/TAIY-S-A0009098652/TAIY-S-A0009097792-1.pdf?src-supplier=IHS+Markit; ComponentLink1Description: https://datasheet.ciiva.com:443/pdfs/VipMasterIC/IC/TAIY/TAIY-S-A0009098652/TAIY-S-A0009097792-1.pdf?src-supplier=IHS+Markit; ComponentLink2URL: https://datasheet.ciiva.com/1040/cbmf1608t100k-ss-1040608.pdf?src-supplier=Digi-Key; ComponentLink2Description: https://datasheet.ciiva.com/1040/cbmf1608t100k-ss-1040608.pdf?src-supplier=Digi-Key; ComponentLink3URL: https://datasheet.ciiva.com/26871/getdatasheetpartid-638595-26871191.pdf?src-supplier=Verical; ComponentLink3Description: https://datasheet.ciiva.com/26871/getdatasheetpartid-638595-26871191.pdf?src-supplier=Verical; ComponentLink4URL: https://datasheet.ciiva.com/15981/521cbmf1608t100k-15981672.pdf?src-supplier=Onlinecomponents.com; ComponentLink4Description: https://datasheet.ciiva.com/15981/521cbmf1608t100k-15981672.pdf?src-supplier=Onlinecomponents.com; ComponentLink5URL: https://datasheet.ciiva.com/46395/1521599-46395181.pdf?src-supplier=Element14; ComponentLink5Description: https://datasheet.ciiva.com/46395/1521599-46395181.pdf?src-supplier=Element14
L4 = I-0402(1005): General Purpose Inductor, 0.009uH, 2%, 1 Element, SMD; Manufacturer: Murata; Manufacturer Part Number: LQW15AN9N0G80D; Current Rating: 1.42A; Shielding: Unshielded; DC Resistance (DCR): 70mR; Self Resonant Frequency: 6.5GHz; Test Frequency: 100MHz; Supplier 1: Digi-Key; Supplier Part Number 1: 490-14715-1-ND; RoHS: Yes; Category: Fixed Inductors; Stock 1: 10351; Pricing 1: 1=0.25000, 10=0.22100, 100=0.15180, 500=0.12972, 1000=0.09936, 2500=0.09384 (USD); Mount: Surface Mount; Case/Package: 0402; Min Operating Temperature: -55°C; Max Operating Temperature: 125°C; Tolerance: 2%; Packaging: Tape and Reel; Composition: Wirewound; Inductance: 9nH; Length: 0.039inch; Width: 0.024inch; Height - Seated (Max): 0.024inch; ComponentLink1URL: https://datasheet.ciiva.com:443/pdfs/VipMasterIC/IC/MURE/MURE-S-A0004390746/MURE-S-A0004390720-1.pdf?src-supplier=IHS+Markit; ComponentLink1Description: https://datasheet.ciiva.com:443/pdfs/VipMasterIC/IC/MURE/MURE-S-A0004390746/MURE-S-A0004390720-1.pdf?src-supplier=IHS+Markit; ComponentLink2URL: https://search.murata.co.jp/Ceramy/image/img/P02/partnumbering_LQ3E.pdf?src-supplier=Digi-Key; ComponentLink2Description: https://search.murata.co.jp/Ceramy/image/img/P02/partnumbering_LQ3E.pdf?src-supplier=Digi-Key; ComponentLink3URL: https://search.murata.co.jp/Ceramy/image/img/P02/JELF243A-0100.pdf?src-supplier=Digi-Key; ComponentLink3Description: https://search.murata.co.jp/Ceramy/image/img/P02/JELF243A-0100.pdf?src-supplier=Digi-Key
L5 = I-0402(1005): General Purpose Inductor, 0.002uH, 5%, 1 Element, Ceramic-Core, SMD, 0402; Manufacturer: Abracon; Manufacturer Part Number: AISC-0402-2N0J-T; DC Resistance (DCR): 70mR; Test Frequency: 250MHz; Max DC Current: 1.04A; Shielding: Unshielded; Q Factor: 16; Self Resonant Frequency: 11.1GHz; Supplier 1: Digi-Key; Supplier Part Number 1: 535-10424-1-ND; RoHS: Yes; Category: Inductors; Stock 1: 4311; Pricing 1: 1=0.34000, 10=0.30400, 100=0.20870, 500=0.17836, 1000=0.13662, 2500=0.12903 (USD); Mount: Surface Mount; Case/Package: 0402; Number of Pins: 2; Case Code (Metric): 1005; Case Code (Imperial): 0402; Core Material: Ceramic; Min Operating Temperature: -40°C; Max Operating Temperature: 125°C; Composition: Wirewound,Ceramic; Inductance: 2nH; Termination: SMD/SMT; DC Current: 1.04A; Military Standard: Not; Package Quantity: 10000; Current Rating: 1.04A; Tolerance: 5%; Packaging: Tape and Reel; Length: 1.19mm; Height: 0.66mm; Height - Seated (Max): 0.026inch; Depth: 0.64mm; Width: 0.025inch; Radiation Hardening: No; ComponentLink1URL: https://datasheet.ciiva.com:443/pdfs/VipMasterIC/IC/ABRC/ABRC-S-A0009700385/ABRC-S-A0009751294-1.pdf?src-supplier=IHS+Markit; ComponentLink1Description: https://datasheet.ciiva.com:443/pdfs/VipMasterIC/IC/ABRC/ABRC-S-A0009700385/ABRC-S-A0009751294-1.pdf?src-supplier=IHS+Markit; ComponentLink2URL: https://datasheet.ciiva.com/26928/getdatasheetpartid-762366-26928064.pdf?src-supplier=Verical; ComponentLink2Description: https://datasheet.ciiva.com/26928/getdatasheetpartid-762366-26928064.pdf?src-supplier=Verical; ComponentLink3URL: https://datasheet.ciiva.com/11140/aisc-0402-11140262.pdf?src-supplier=Avnet; ComponentLink3Description: https://datasheet.ciiva.com/11140/aisc-0402-11140262.pdf?src-supplier=Avnet; ComponentLink4URL: https://datasheet.ciiva.com/1054/aisc-0402-1054030.pdf?src-supplier=Digi-Key; ComponentLink4Description: https://datasheet.ciiva.com/1054/aisc-0402-1054030.pdf?src-supplier=Digi-Key; ComponentLink5URL: https://datasheet.ciiva.com/1054/aisc-0402-1054031.pdf?src-supplier=Digi-Key; ComponentLink5Description: https://datasheet.ciiva.com/1054/aisc-0402-1054031.pdf?src-supplier=Digi-Key; ComponentLink6URL: https://datasheet.ciiva.com/1054/aisc-0402-1054032.pdf?src-supplier=Digi-Key; ComponentLink6Description: https://datasheet.ciiva.com/1054/aisc-0402-1054032.pdf?src-supplier=Digi-Key
R4 R16 = R-0402(1005): Fixed Resistor, Thin Film, 0.0625W, 422ohm, 50V, 0.1% +/-Tol, 25ppm/Cel, Surface Mount, 0402; Manufacturer: Yageo; Manufacturer Part Number: RT0402BRD07422RL; Power Rating: 62.5mW; Temperature Coefficient: 25ppm/°C; Supplier 1: Digi-Key; Supplier Part Number 1: YAG4263CT-ND; RoHS: Yes; Category: Chip SMD Resistors; Stock 1: 9302; Pricing 1: 1=0.39000, 10=0.27800, 100=0.11140, 1000=0.05488, 2500=0.05084, 5000=0.04600 (USD); Case/Package: 0402; Case Code (Metric): 1005; Case Code (Imperial): 0402; Min Operating Temperature: -55°C; Max Operating Temperature: 125°C; Voltage Rating: 50V; Resistance: 422R; Tolerance: 0.1%; Packaging: Tape and Reel; Termination: SMD/SMT; Voltage Rating (DC): 50V; Length: 1mm; Height: 350um; Width: 500um; Lead Free: Lead Free; ComponentLink1URL: https://datasheet.ciiva.com:443/pdfs/VipMasterIC/IC/YAGO/YAGO-S-A0008510989/YAGO-S-A0008510989-1.pdf?src-supplier=IHS+Markit; ComponentLink1Description: https://datasheet.ciiva.com:443/pdfs/VipMasterIC/IC/YAGO/YAGO-S-A0008510989/YAGO-S-A0008510989-1.pdf?src-supplier=IHS+Markit; ComponentLink2URL: https://datasheet.ciiva.com/12705/pyu-rt-1-to-0-05-rohs-l-4-12705867.pdf?src-supplier=Mouser; ComponentLink2Description: https://datasheet.ciiva.com/12705/pyu-rt-1-to-0-05-rohs-l-4-12705867.pdf?src-supplier=Mouser
R5 R7 R17 R20-R25 R30-R34 = R-0402(1005): Fixed Resistor, Metal Glaze/thick Film, 0.0625W, 3300ohm, 50V, 1% +/-Tol, 100ppm/Cel, Surface Mount, 0402; Manufacturer: Yageo; Manufacturer Part Number: AC0402FR-073K3L; Power Rating: 62.5mW; Max Power Dissipation: 63mW; Temperature Coefficient: 100ppm/°C; Supplier 1: Digi-Key; Supplier Part Number 1: YAG3483CT-ND; RoHS: Yes; Category: Chip SMD Resistors; Pricing 1: 1=0.10000, 10=0.02100, 100=0.00870, 1000=0.00390, 2500=0.00338, 5000=0.00279 (USD); Case/Package: 0402; Case Code (Imperial): 0402; Case Code (Metric): 1005; Min Operating Temperature: -55°C; Max Operating Temperature: 155°C; Tolerance: 1%; Packaging: Tape and Reel; Resistance: 3.3kR; Voltage Rating: 50V; Composition: Thick Film; Number of Terminations: 2; Termination: SMD/SMT; Features: Moisture Resistant,Automotive AEC-Q200; Length: 0.039inch; Height: 0.015inch; Width: 0.02inch; Lead Free: Lead Free; ComponentLink1URL: https://datasheet.ciiva.com:443/pdfs/VipMasterIC/IC/YAGO/YAGO-S-A0003597364/YAGO-S-A0003597364-1.pdf?src-supplier=IHS+Markit; ComponentLink1Description: https://datasheet.ciiva.com:443/pdfs/VipMasterIC/IC/YAGO/YAGO-S-A0003597364/YAGO-S-A0003597364-1.pdf?src-supplier=IHS+Markit; ComponentLink2URL: http://www.mouser.com/ds/2/447/yageodocoutput-1111992.pdf?src-supplier=Mouser; ComponentLink2Description: http://www.mouser.com/ds/2/447/yageodocoutput-1111992.pdf?src-supplier=Mouser; ComponentLink3URL: http://www.yageo.com/NewPortal/yageodocoutput?fileName=/pdf/R-Chip/PYu-AC_51_RoHS_L_6.pdf&src-supplier=Digi-Key; ComponentLink3Description: http://www.yageo.com/NewPortal/yageodocoutput?fileName=/pdf/R-Chip/PYu-AC_51_RoHS_L_6.pdf&src-supplier=Digi-Key; ComponentLink4URL: http://www.yageo.com/documents/recent/PYu-AC_51_RoHS_L_2_revised.pdf?src-supplier=Future+Electronics; ComponentLink4Description: http://www.yageo.com/documents/recent/PYu-AC_51_RoHS_L_2_revised.pdf?src-supplier=Future+Electronics
R18 R19 = R-0402(1005): Fixed Resistor, Metal Glaze/thick Film, 0.0625W, 10000ohm, 50V, 1% +/-Tol, 100ppm/Cel, Surface Mount, 0402; Manufacturer: Yageo; Manufacturer Part Number: AC0402FR-0710KL; Power Rating: 62.5mW; Temperature Coefficient: 100ppm/°C; Max Power Dissipation: 63mW; Supplier 1: Digi-Key; Supplier Part Number 1: YAG3436CT-ND; RoHS: Yes; Category: Chip SMD Resistors; Stock 1: 922338; Pricing 1: 1=0.10000, 10=0.02100, 100=0.00870, 1000=0.00390, 2500=0.00338, 5000=0.00279 (USD); Case/Package: 0402; Case Code (Imperial): 0402; Case Code (Metric): 1005; Min Operating Temperature: -55°C; Max Operating Temperature: 155°C; Resistance: 10kR; Tolerance: 1%; Voltage Rating: 50V; Packaging: Tape and Reel; Composition: Thick Film; Termination: SMD/SMT; Number of Terminations: 2; Military Standard: Not; Features: Moisture Resistant,Automotive AEC-Q200; Length: 0.039inch; Height: 0.015inch; Width: 0.02inch; Depth: 0.5mm; Lead Free: Lead Free; ComponentLink1URL: https://datasheet.ciiva.com:443/pdfs/VipMasterIC/IC/YAGO/YAGO-S-A0003597364/YAGO-S-A0003597364-1.pdf?src-supplier=IHS+Markit; ComponentLink1Description: https://datasheet.ciiva.com:443/pdfs/VipMasterIC/IC/YAGO/YAGO-S-A0003597364/YAGO-S-A0003597364-1.pdf?src-supplier=IHS+Markit; ComponentLink2URL: https://datasheet.ciiva.com/12656/pyu-ac-51-rohs-l-2-12656634.pdf?src-supplier=Mouser; ComponentLink2Description: https://datasheet.ciiva.com/12656/pyu-ac-51-rohs-l-2-12656634.pdf?src-supplier=Mouser
SW2 = CMP-1677-00001-4: Sealed Tactile Switch, SPST-NO, 3 to 24 V, -25 to 70 degC, 4-Pin SMD, RoHS, Bulk; Manufacturer: Omron; Manufacturer Part Number: B3S-1000P; Mechanical Life: 500000Cycles; Switch Function: Off-Mom; Illumination Type: Non-Illuminated; Number of Poles: 1; Switch Travel: 0.25mm; Throw Configuration: SPST; Voltage Rating (DC): 24V; Operating Force: 1.57N; Max Current Rating: 50mA; Contact Resistance: 100mR; Actuator Type: Standard; Actuator Length: 0.8mm; Ratings: IP67,Waterproof,Dust Tight; Supplier 1: Digi-Key; Supplier Part Number 1: SW836CT-ND; RoHS: Yes; Category: Tactile Switches; Stock 1: 209545; Pricing 1: 1=0.80000, 10=0.77500, 25=0.74520, 100=0.64690, 250=0.59024, 500=0.54850 (USD); Mount: Surface Mount; Weight: 0.010582oz; Contact Material: Bronze; Contact Plating: Silver; Min Operating Temperature: -25°C; Max Operating Temperature: 70°C; Orientation: Straight; Termination: Gull Wing; Electrical Life: 500000Cycles; Packaging: Tape and Reel; Package Quantity: 1; Current Rating: 50mA; Max Voltage Rating (DC): 24V; Contact Current Rating: 50mA; Length: 6.6mm; Height: 3.65mm; Depth: 9mm; Width: 6mm; Radiation Hardening: No; REACH SVHC: No SVHC; Lead Free: Lead Free; ComponentLink1URL: https://datasheet.ciiva.com:443/pdfs/VipMasterIC/IC/OMRN/OMRN-S-A0001309939/OMRN-S-A0001309939-1.pdf?src-supplier=IHS+Markit; ComponentLink1Description: https://datasheet.ciiva.com:443/pdfs/VipMasterIC/IC/OMRN/OMRN-S-A0001309939/OMRN-S-A0001309939-1.pdf?src-supplier=IHS+Markit; ComponentLink2URL: https://datasheet.ciiva.com/2899/b3s-1110-2899873.pdf?src-supplier=Digi-Key; ComponentLink2Description: https://datasheet.ciiva.com/2899/b3s-1110-2899873.pdf?src-supplier=Digi-Key; ComponentLink3URL: https://datasheet.ciiva.com/2899/b3s-1110-2899874.pdf?src-supplier=Digi-Key; ComponentLink3Description: https://datasheet.ciiva.com/2899/b3s-1110-2899874.pdf?src-supplier=Digi-Key; ComponentLink4URL: https://datasheet.ciiva.com/2899/b3s-1110-2899875.pdf?src-supplier=Digi-Key; ComponentLink4Description: https://datasheet.ciiva.com/2899/b3s-1110-2899875.pdf?src-supplier=Digi-Key; ComponentLink5URL: https://datasheet.ciiva.com/15183/getdatasheetpartid-211358-15183771.pdf?src-supplier=Verical; ComponentLink5Description: https://datasheet.ciiva.com/15183/getdatasheetpartid-211358-15183771.pdf?src-supplier=Verical; ComponentLink6URL: https://datasheet.ciiva.com/27056/2086750-27056652.pdf?src-supplier=Jameco; ComponentLink6Description: https://datasheet.ciiva.com/27056/2086750-27056652.pdf?src-supplier=Jameco; ComponentLink7URL: https://datasheet.ciiva.com/16155/en-b3s-16155006.pdf?src-supplier=Onlinecomponents.com; ComponentLink7Description: https://datasheet.ciiva.com/16155/en-b3s-16155006.pdf?src-supplier=Onlinecomponents.com; ComponentLink8URL: https://datasheet.ciiva.com/30125/en-b3s-30125455.pdf?src-supplier=Onlinecomponents.com; ComponentLink8Description: https://datasheet.ciiva.com/30125/en-b3s-30125455.pdf?src-supplier=Onlinecomponents.com
TP1-TP10 TP19 = S1751-46R: PC TEST POINT TIN SMD; Manufacturer: Harwin Inc.; Supplier 1: Digi-Key; RoHS: RoHS Compliant; Stock 1: 275112; Pricing 1: 1=0.29, 10=0.272, 25=0.2324, 50=0.2032, 100=0.1888, 250=0.167, 500=0.15972, 1000=0.13068 (USD); Packaging: Cut Tape (CT); Type: PC Test Point; Terminal: 0.128" x 0.065" x 0.079" (3.25mm x 1.65mm x 2.00mm) Brass, Tin Plated; Mounting Type: Surface Mount; Material: Copper Alloy; Color: Natural; ComponentLink1URL: http://cdn.harwin.com/pdfs/S1751.pdf; ComponentLink1Description: http://cdn.harwin.com/pdfs/S1751.pdf; Supplier Part Number 1: 952-1478-1-ND; Manufacturer Part Number: S1751-46R; Category: Test and Measurement
U1 = NRSC-NRF52832-QF-48: Multiprotocol Bluetooth Smart, ANT/ANT+ and Proprietary System-on-Chip, 2.4 GHz, 256 KB FLASH, 1.7 to 3.6 V, -40 to 85 degC, 48-Pin QFN, RoHS, Tape and Reel; Manufacturer: Nordic Semiconductor; Interface: SPI,UART; Frequency: 2.4GHz; Data Rate: 2Mbps; Sensitivity: -96dBm; Memory Size: 64KB; Number of GPIO: 32; Current - Receiving: 5.4mA; Current - Transmitting: 7.5mA; Supplier 1: Digi-Key; Supplier Part Number 1: 1490-1067-1-ND; Manufacturer Part Number: NRF52832-QFAA-R7; RoHS: No; Category: RF Receivers, Transceivers; Stock 1: 7487; Pricing 1: 1=5.46000, 10=4.87500, 25=4.38760, 100=3.99750, 250=3.60752, 500=3.23700 (USD); Packaging: Tape and Reel; ComponentLink1URL: https://datasheet.ciiva.com:443/pdfs/VipMasterIC/IC/NRSA/NRSA-S-A0002414264/NRSA-S-A0002414264-1.pdf?src-supplier=IHS+Markit; ComponentLink1Description: https://datasheet.ciiva.com:443/pdfs/VipMasterIC/IC/NRSA/NRSA-S-A0002414264/NRSA-S-A0002414264-1.pdf?src-supplier=IHS+Markit; ComponentLink5URL: http://infocenter.nordicsemi.com/pdf/nRF52832_PB_v1.7.pdf?src-supplier=Digi-Key; ComponentLink5Description: http://infocenter.nordicsemi.com/pdf/nRF52832_PB_v1.7.pdf?src-supplier=Digi-Key; ComponentLink6URL: http://infocenter.nordicsemi.com/pdf/nRF52832_PS_v1.4.pdf?src-supplier=Digi-Key; ComponentLink6Description: http://infocenter.nordicsemi.com/pdf/nRF52832_PS_v1.4.pdf?src-supplier=Digi-Key
X1 = CRYSTAL_32MHz: Parallel - Fundamental Quartz Crystal, 32MHz Nom; Manufacturer: Diodes; Manufacturer Part Number: US3200005Z; Load Capacitance: 8pF; ESR (Equivalent Series Resistance): 80R; Frequency Stability: 10ppm; Supplier 1: Digi-Key; Supplier Part Number 1: US3200005ZCT-ND; RoHS: Yes; Category: Crystals; Pricing 1: 1=1.45000, 10=1.38400, 50=1.35200, 100=1.15880, 500=1.12666, 1000=0.94961 (USD); Mount: Surface Mount; Case/Package: SMD/SMT; Min Operating Temperature: -20°C; Max Operating Temperature: 70°C; Packaging: Tape and Reel; Frequency: 32MHz; Frequency Tolerance: 10ppm; Length: 0.063inch; Height: 0.014inch; Width: 0.047inch; ComponentLink1URL: https://datasheet.ciiva.com:443/pdfs/VipMasterIC/IC/DIOD/DIOD-S-A0002236499/DIOD-S-A0002236499-1.pdf?src-supplier=IHS+Markit; ComponentLink1Description: https://datasheet.ciiva.com:443/pdfs/VipMasterIC/IC/DIOD/DIOD-S-A0002236499/DIOD-S-A0002236499-1.pdf?src-supplier=IHS+Markit; ComponentLink2URL: https://media.digikey.com/pdf/Data%20Sheets/Pericom%20PDFs/US3200005Z_Ver.A.pdf?src-supplier=Digi-Key; ComponentLink2Description: https://media.digikey.com/pdf/Data%20Sheets/Pericom%20PDFs/US3200005Z_Ver.A.pdf?src-supplier=Digi-Key
X2 = CRYSTAL_32K768: Parallel - Fundamental Quartz Crystal, 0.032768MHz Nom; Manufacturer: ECS International; Manufacturer Part Number: ECS-.327-9-1210-TR; Frequency Tolerance: 20ppm; Load Capacitance: 9pF; ESR (Equivalent Series Resistance): 90kR; Supplier 1: Digi-Key; Supplier Part Number 1: XC2283CT-ND; RoHS: No; Category: Crystals and Oscillators; Stock 1: 5205; Pricing 1: 1=1.52000, 10=1.45400, 50=1.42060, 100=1.21770, 500=1.18388, 1000=0.99784, 2500=0.94710 (USD); Mount: Surface Mount; Case/Package: SMD/SMT; Min Operating Temperature: -40°C; Max Operating Temperature: 85°C; Packaging: Tape and Reel; Frequency: 32.768kHz; ComponentLink1URL: https://datasheet.ciiva.com:443/pdfs/VipMasterIC/IC/ECSI/ECSI-S-A0009254912/ECSI-S-A0009254912-1.pdf?src-supplier=IHS+Markit; ComponentLink1Description: https://datasheet.ciiva.com:443/pdfs/VipMasterIC/IC/ECSI/ECSI-S-A0009254912/ECSI-S-A0009254912-1.pdf?src-supplier=IHS+Markit; ComponentLink2URL: https://www.ecsxtal.com/store/pdf/ECX-1210.pdf?src-supplier=Digi-Key; ComponentLink2Description: https://www.ecsxtal.com/store/pdf/ECX-1210.pdf?src-supplier=Digi-Key

## Sheet DB_Power-X01.SchDoc: DB POWER
size Letter; Author: C. DEMOLDER; Engineer: C. DEMOLDER; Organization: GEORGIA TECH; Address1: NORTH AVE NW; Address2: ATLANTA, GA, 30332; DocumentNumber: P001; Revision: X01; SheetNumber: 3; SheetTotal: 4
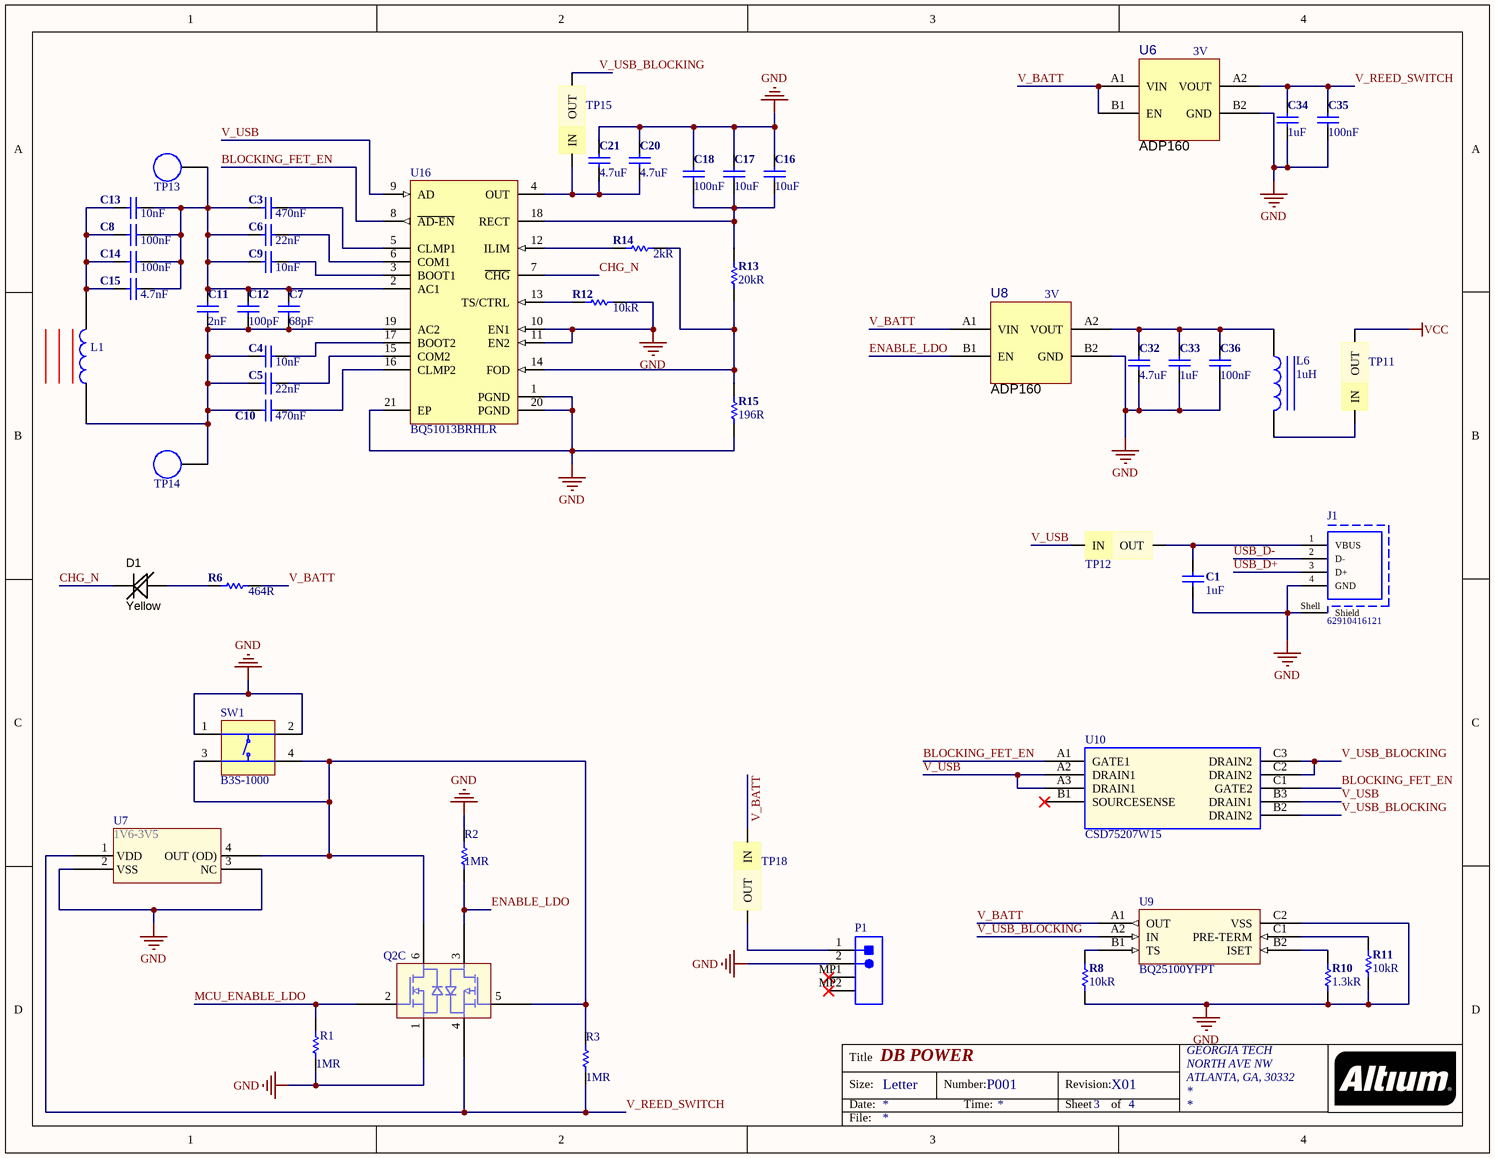
[diagram p1: DB_Power-X01.SchDoc]